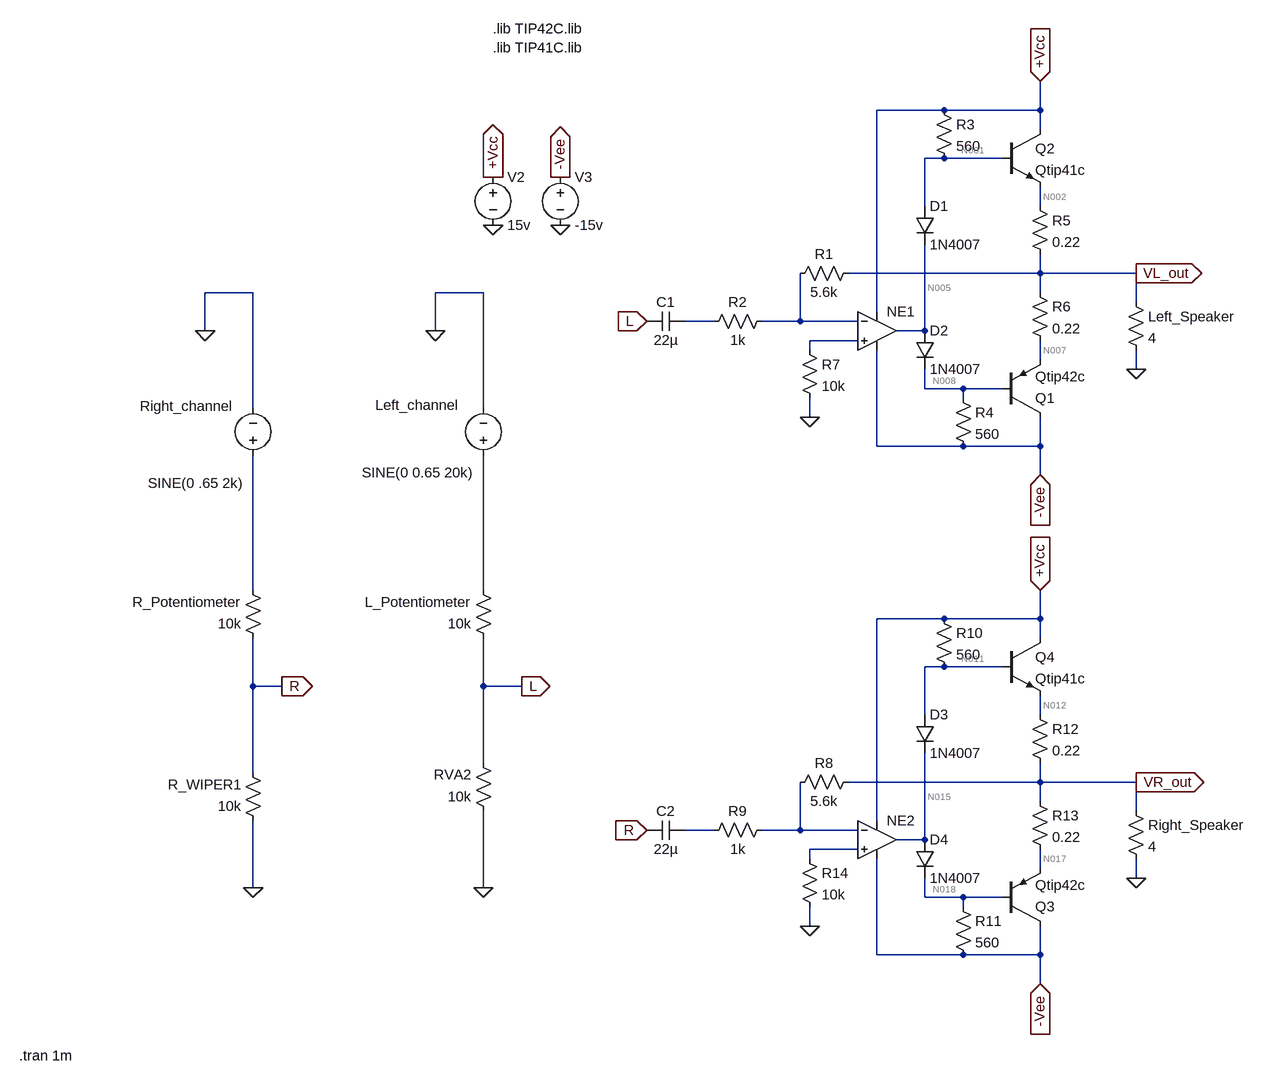
[diagram p0: schematic Stereo Mode.asc]
Stereo Mode.asc, the LTspice schematic file:
Version 4.1
SHEET 1 1348 1680
WIRE 832 -64 720 -64
WIRE 992 -64 992 -112
WIRE 992 -64 832 -64
WIRE 992 -32 992 -64
WIRE 832 16 800 16
WIRE 928 16 832 16
WIRE 800 96 800 16
WIRE 992 96 992 64
WIRE 992 208 992 176
WIRE 992 208 672 208
WIRE 1152 208 992 208
WIRE -320 240 -400 240
WIRE 64 240 -16 240
WIRE 992 240 992 208
WIRE 1152 256 1152 208
WIRE 720 272 720 -64
WIRE 448 288 400 288
WIRE 592 288 592 208
WIRE 592 288 528 288
WIRE 688 288 592 288
WIRE -400 304 -400 240
WIRE -16 304 -16 240
WIRE 800 304 800 160
WIRE 800 304 752 304
WIRE 688 320 608 320
WIRE 608 336 608 320
WIRE 992 352 992 320
WIRE 1152 368 1152 336
WIRE 800 400 800 368
WIRE 864 400 800 400
WIRE 928 400 864 400
WIRE 864 416 864 400
WIRE -320 432 -320 240
WIRE 64 432 64 240
WIRE 608 448 608 416
WIRE 720 496 720 336
WIRE 864 496 720 496
WIRE 992 496 992 448
WIRE 992 496 864 496
WIRE 992 544 992 496
WIRE -320 736 -320 512
WIRE 64 736 64 512
WIRE 832 784 720 784
WIRE 992 784 992 736
WIRE 992 784 832 784
WIRE 992 816 992 784
WIRE 832 864 800 864
WIRE 928 864 832 864
WIRE -320 896 -320 816
WIRE -272 896 -320 896
WIRE 64 896 64 816
WIRE 128 896 64 896
WIRE 800 944 800 864
WIRE 992 944 992 912
WIRE 64 1024 64 896
WIRE -320 1040 -320 896
WIRE 992 1056 992 1024
WIRE 992 1056 672 1056
WIRE 1152 1056 992 1056
WIRE 992 1088 992 1056
WIRE 1152 1104 1152 1056
WIRE 720 1120 720 784
WIRE 448 1136 400 1136
WIRE 592 1136 592 1056
WIRE 592 1136 528 1136
WIRE 688 1136 592 1136
WIRE 800 1152 800 1008
WIRE 800 1152 752 1152
WIRE 688 1168 608 1168
WIRE 608 1184 608 1168
WIRE 992 1200 992 1168
WIRE 1152 1216 1152 1184
WIRE -320 1232 -320 1120
WIRE 64 1232 64 1104
WIRE 800 1248 800 1216
WIRE 864 1248 800 1248
WIRE 928 1248 864 1248
WIRE 864 1264 864 1248
WIRE 608 1296 608 1264
WIRE 720 1344 720 1184
WIRE 864 1344 720 1344
WIRE 992 1344 992 1296
WIRE 992 1344 864 1344
WIRE 992 1392 992 1344
FLAG 1152 208 VL_out
IOPIN 1152 208 Out
FLAG 608 448 0
FLAG 1152 368 0
FLAG 80 128 0
FLAG 192 128 0
FLAG 80 48 +Vcc
IOPIN 80 48 Out
FLAG 192 48 -Vee
IOPIN 192 48 Out
FLAG 992 -112 +Vcc
IOPIN 992 -112 In
FLAG 992 544 -Vee
IOPIN 992 544 In
FLAG 1152 1056 VR_out
IOPIN 1152 1056 Out
FLAG 608 1296 0
FLAG 1152 1216 0
FLAG 992 736 +Vcc
IOPIN 992 736 In
FLAG 992 1392 -Vee
IOPIN 992 1392 In
FLAG 336 288 L
IOPIN 336 288 In
FLAG 336 1136 R
IOPIN 336 1136 In
FLAG 64 1232 0
FLAG -320 1232 0
FLAG -400 304 0
FLAG -16 304 0
FLAG -272 896 R
IOPIN -272 896 Out
FLAG 128 896 L
IOPIN 128 896 Out
SYMBOL pnp 928 448 M180
SYMATTR InstName Q1
SYMATTR Value Qtip42c
SYMBOL npn 928 -32 R0
SYMATTR InstName Q2
SYMATTR Value Qtip41c
SYMBOL res 1136 240 R0
SYMATTR InstName Left_Speaker
SYMATTR Value 4
SYMBOL res 688 192 R90
WINDOW 0 0 56 VBottom 2
WINDOW 3 32 56 VTop 2
SYMATTR InstName R1
SYMATTR Value 5.6k
SYMBOL res 544 272 R90
WINDOW 0 0 56 VBottom 2
WINDOW 3 32 56 VTop 2
SYMATTR InstName R2
SYMATTR Value 1k
SYMBOL voltage 80 32 R0
SYMATTR InstName V2
SYMATTR Value 15v
SYMBOL voltage 192 32 R0
SYMATTR InstName V3
SYMATTR Value -15v
SYMBOL diode 784 96 R0
SYMATTR InstName D1
SYMATTR Value 1N4007
SYMBOL diode 784 304 R0
SYMATTR InstName D2
SYMATTR Value 1N4007
SYMBOL res 816 -80 R0
SYMATTR InstName R3
SYMATTR Value 560
SYMBOL res 848 400 R0
SYMATTR InstName R4
SYMATTR Value 560
SYMBOL cap 400 272 R90
WINDOW 0 0 32 VBottom 2
WINDOW 3 32 32 VTop 2
SYMATTR InstName C1
SYMATTR Value 22µ
SYMBOL res 976 80 R0
SYMATTR InstName R5
SYMATTR Value 0.22
SYMBOL res 976 224 R0
SYMATTR InstName R6
SYMATTR Value 0.22
SYMBOL res 592 320 R0
SYMATTR InstName R7
SYMATTR Value 10k
SYMBOL OpAmps\\UniversalOpAmp2 720 304 R0
SYMATTR InstName NE1
SYMATTR Value2 Avol=100k GBW=10Meg Slew=9Meg
SYMATTR SpiceLine Ilimit=38m Rail=0 Vos=0
SYMBOL pnp 928 1296 M180
SYMATTR InstName Q3
SYMATTR Value Qtip42c
SYMBOL npn 928 816 R0
SYMATTR InstName Q4
SYMATTR Value Qtip41c
SYMBOL res 1136 1088 R0
SYMATTR InstName Right_Speaker
SYMATTR Value 4
SYMBOL res 688 1040 R90
WINDOW 0 0 56 VBottom 2
WINDOW 3 32 56 VTop 2
SYMATTR InstName R8
SYMATTR Value 5.6k
SYMBOL res 544 1120 R90
WINDOW 0 0 56 VBottom 2
WINDOW 3 32 56 VTop 2
SYMATTR InstName R9
SYMATTR Value 1k
SYMBOL diode 784 944 R0
SYMATTR InstName D3
SYMATTR Value 1N4007
SYMBOL diode 784 1152 R0
SYMATTR InstName D4
SYMATTR Value 1N4007
SYMBOL res 816 768 R0
SYMATTR InstName R10
SYMATTR Value 560
SYMBOL res 848 1248 R0
SYMATTR InstName R11
SYMATTR Value 560
SYMBOL cap 400 1120 R90
WINDOW 0 0 32 VBottom 2
WINDOW 3 32 32 VTop 2
SYMATTR InstName C2
SYMATTR Value 22µ
SYMBOL res 976 928 R0
SYMATTR InstName R12
SYMATTR Value 0.22
SYMBOL res 976 1072 R0
SYMATTR InstName R13
SYMATTR Value 0.22
SYMBOL res 592 1168 R0
SYMATTR InstName R14
SYMATTR Value 10k
SYMBOL OpAmps\\UniversalOpAmp2 720 1152 R0
SYMATTR InstName NE2
SYMATTR Value2 Avol=100k GBW=10Meg Slew=9Meg
SYMATTR SpiceLine Ilimit=38m Rail=0 Vos=0
SYMBOL voltage 64 528 R180
WINDOW 0 111 116 Bottom 2
WINDOW 3 110 -28 Top 2
WINDOW 123 0 0 Left 0
WINDOW 39 0 0 Left 0
SYMATTR InstName Left_channel
SYMATTR Value SINE(0 0.65 20k)
SYMBOL voltage -320 528 R180
WINDOW 0 111 114 Bottom 2
WINDOW 3 96 -45 Top 2
WINDOW 123 0 0 Left 0
WINDOW 39 0 0 Left 0
SYMATTR InstName Right_channel
SYMATTR Value SINE(0 .65 2k)
SYMBOL res 80 832 R180
WINDOW 0 36 76 Left 2
WINDOW 3 36 40 Left 2
SYMATTR InstName L_Potentiometer
SYMATTR Value 10k
SYMBOL res 80 1120 R180
WINDOW 0 36 76 Left 2
WINDOW 3 36 40 Left 2
SYMATTR InstName RVA2
SYMATTR Value 10k
SYMBOL res -304 832 R180
WINDOW 0 36 76 Left 2
WINDOW 3 36 40 Left 2
SYMATTR InstName R_Potentiometer
SYMATTR Value 10k
SYMBOL res -304 1136 R180
WINDOW 0 36 76 Left 2
WINDOW 3 36 40 Left 2
SYMATTR InstName R_WIPER1
SYMATTR Value 10k
TEXT 80 -200 Left 2 !.lib TIP42C.lib
TEXT 80 -168 Left 2 !.lib TIP41C.lib
TEXT -2432 1512 Left 2 !.tran 1m

The netlist it stands for:
* Stereo Mode.asc
Q1 -Vee N008 N007 0 Qtip42c
Q2 +Vcc N001 N002 0 Qtip41c
R§Left_Speaker VL_out 0 4
R1 VL_out N004 5.6k
R2 N004 N003 1k
V2 +Vcc 0 15v
V3 -Vee 0 -15v
D1 N001 N005 1N4007
D2 N005 N008 1N4007
R3 +Vcc N001 560
R4 N008 -Vee 560
C1 N003 L 22µ
R5 N002 VL_out 0.22
R6 VL_out N007 0.22
R7 N006 0 10k
X§NE1 N006 N004 +Vcc -Vee N005 level2 Avol=100k GBW=10Meg Slew=9Meg Ilimit=38m Rail=0 Vos=0 En=0 Enk=0 In=0 Ink=0 Rin=500Meg  ; pins In+ In- V+ V- OUT
Q3 -Vee N018 N017 0 Qtip42c
Q4 +Vcc N011 N012 0 Qtip41c
Right_Speaker VR_out 0 4
R8 VR_out N014 5.6k
R9 N014 N013 1k
D3 N011 N015 1N4007
D4 N015 N018 1N4007
R10 +Vcc N011 560
R11 N018 -Vee 560
C2 N013 R 22µ
R12 N012 VR_out 0.22
R13 VR_out N017 0.22
R14 N016 0 10k
X§NE2 N016 N014 +Vcc -Vee N015 level2 Avol=100k GBW=10Meg Slew=9Meg Ilimit=38m Rail=0 Vos=0 En=0 Enk=0 In=0 Ink=0 Rin=500Meg  ; pins In+ In- V+ V- OUT
V§Left_channel N010 0 SINE(0 0.65 20k)
V§Right_channel N009 0 SINE(0 .65 2k)
R§L_Potentiometer L N010 10k
RVA2 0 L 10k
R_Potentiometer R N009 10k
R_WIPER1 0 R 10k
.model D D
.lib standard.dio
.model NPN NPN
.model PNP PNP
.lib standard.bjt
.lib TIP42C.lib
.lib TIP41C.lib
.tran 1m
.lib UniversalOpAmp2.lib
.backanno
.end

* Results of the author's LTspice run, read from the files saved beside the schematic
* Operating Point, zero values left out:
*   V(+vcc) = 15 V
*   V(-vee) = -15 V
*   V(n001) = 703.1 mV
*   V(n002) = 54.45 mV
*   V(n005) = 216.7 µV
*   V(n007) = -54.45 mV
*   V(n008) = -702.4 mV
*   V(n011) = 703.1 mV
*   V(n012) = 54.45 mV
*   V(n015) = 216.7 µV
*   V(n017) = -54.45 mV
*   V(n018) = -702.4 mV
*   I(D1) = 23.58 mA
*   I(D2) = 23.46 mA
*   I(D3) = 23.58 mA
*   I(D4) = 23.46 mA
*   I(Left_Speaker) = 1.656 nA
*   I(R10) = 25.53 mA
*   I(R11) = 25.53 mA
*   I(R12) = 247.5 mA
*   I(R13) = 247.5 mA
*   I(R3) = 25.53 mA
*   I(R4) = 25.53 mA
*   I(R5) = 247.5 mA
*   I(R6) = 247.5 mA
*   I(Right_Speaker) = 1.656 nA
*   I(V2) = -545 mA
*   I(V3) = 545 mA
*   Ib(Q1) = -2.069 mA
*   Ib(Q2) = 1.952 mA
*   Ib(Q3) = -2.069 mA
*   Ib(Q4) = 1.952 mA
*   Ic(Q1) = -245.4 mA
*   Ic(Q2) = 245.6 mA
*   Ic(Q3) = -245.4 mA
*   Ic(Q4) = 245.6 mA
*   Ie(Q1) = 247.5 mA
*   Ie(Q2) = -247.5 mA
*   Ie(Q3) = 247.5 mA
*   Ie(Q4) = -247.5 mA
*   Ix(ne1:3) = 1.443 mA
*   Ix(ne1:4) = -1.558 mA
*   Ix(ne1:5) = 115.9 µA
*   Ix(ne2:3) = 1.443 mA
*   Ix(ne2:4) = -1.558 mA
*   Ix(ne2:5) = 115.9 µA